# EAGLE design main (EAGLE 9.0.1)
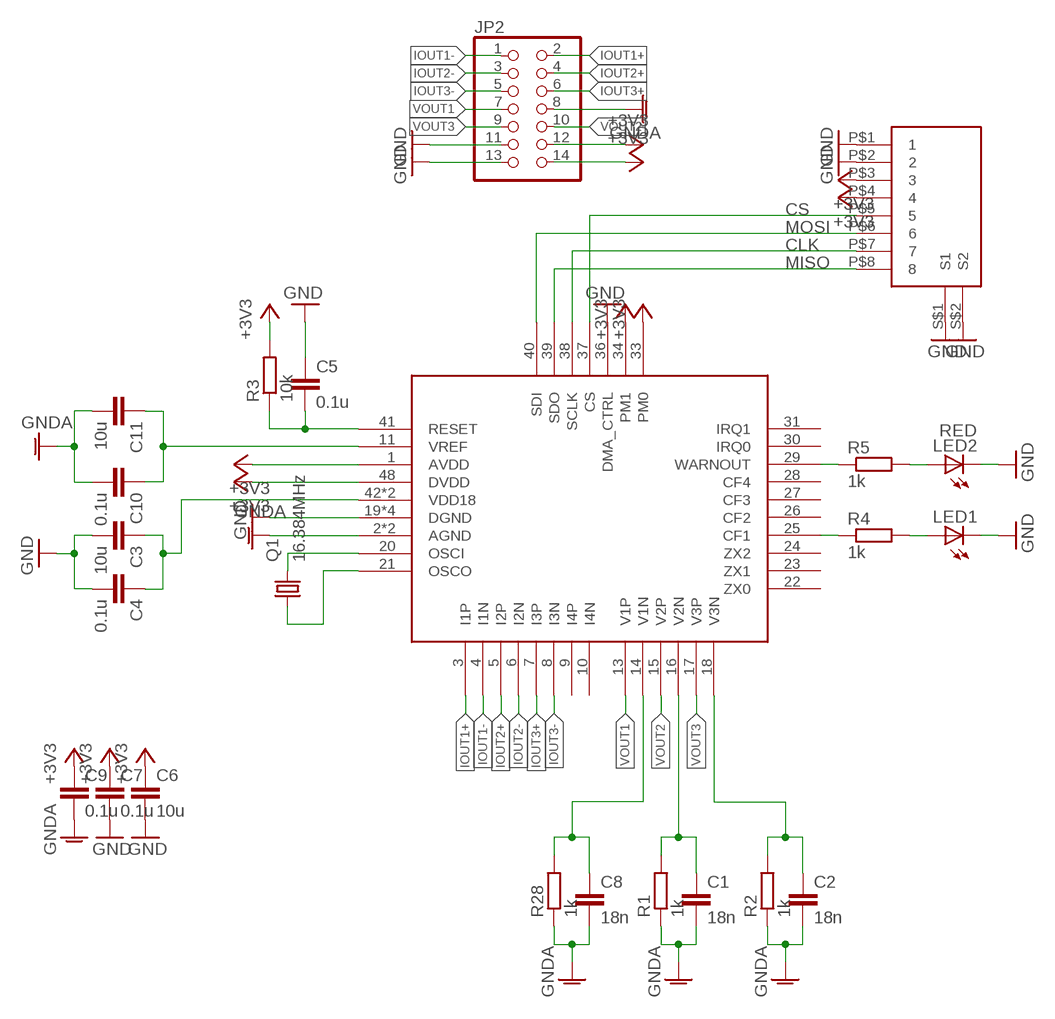
[diagram p0: schematic, sheet 1]

## Parts
C1  18n  C-EUC0805  [C0805]
C2  18n  C-EUC0805  [C0805]
C3  10u  C-EUC1206  [C1206]
C4  0.1u  C-EUC0805  [C0805]
C5  0.1u  C-EUC0805  [C0805]
C6  10u  C-EUC1206  [C1206]
C7  0.1u  C-EUC0805  [C0805]
C8  18n  C-EUC0805  [C0805]
C9  0.1u  C-EUC0805  [C0805]
C10  0.1u  C-EUC0805  [C0805]
C11  10u  C-EUC0805  [C0805]
C12  RJ45-ASSMANN  [RJ45-ASSMANN]
JP2  PINHD-2X7  [2X07]
LED1  LEDCHIPLED_1206  [CHIPLED_1206]
LED2  RED  LEDCHIPLED_1206  [CHIPLED_1206]
Q1  16.384MHz  KX-9A  [5.0X3.2_KX-9A]
R1  1k  R-EU_M0805  [M0805]
R2  1k  R-EU_M0805  [M0805]
R3  10k  R-EU_M0805  [M0805]
R4  1k  R-EU_R0805  [R0805]
R5  1k  R-EU_R0805  [R0805]
R28  1k  R-EU_M0805  [M0805]
U$1  ATM90E36A  [QFP50P900X900X120-48]

## Nets
+3V3: C6.1 C7.1 C9.1 C12.P$3 C12.P$4 JP2.12 JP2.14 R3.2 U$1.1(AVDD) U$1.33(PM0) U$1.34(PM1) U$1.48(DVDD)
CLK: C12.P$7 U$1.38(SCLK)
CS: C12.P$5 U$1.37(CS)
GND: C3.2 C4.2 C5.1 C6.2 C7.2 C12.P$1 C12.P$2 C12.S$1(S1) C12.S$2(S2) JP2.11 JP2.13 LED1.C LED2.C U$1.19(DGND) U$1.32(DGND) U$1.36(DMA_CTRL) U$1.44(DGND) U$1.47(DGND)
GNDA: C1.2 C2.2 C8.2 C9.2 C10.2 C11.2 JP2.8 R1.1 R2.1 R28.1 U$1.2(AGND) U$1.12(AGND)
IOUT1+: JP2.2 U$1.3(I1P)
IOUT1-: JP2.1 U$1.4(I1N)
IOUT2+: JP2.4 U$1.5(I2P)
IOUT2-: JP2.3 U$1.6(I2N)
IOUT3+: JP2.6 U$1.7(I3P)
IOUT3-: JP2.5 U$1.8(I3N)
MISO: C12.P$8 U$1.39(SDO)
MOSI: C12.P$6 U$1.40(SDI)
N$1: Q1.3 U$1.20(OSCI)
N$2: Q1.1 U$1.21(OSCO)
N$3: C5.2 R3.1 U$1.41(RESET)
N$4: C3.1 C4.1 U$1.42(VDD18) U$1.43(VDD18)
N$6: R4.1 U$1.25(CF1)
N$7: LED1.A R4.2
N$8: R5.1 U$1.29(WARNOUT)
N$9: LED2.A R5.2
VOUT1: JP2.7 U$1.13(V1P)
VOUT2: JP2.10 U$1.15(V2P)
VOUT3: JP2.9 U$1.17(V3P)
VOUT4: C8.1 R28.2 U$1.14(V1N)
VOUT5: C1.1 R1.2 U$1.16(V2N)
VOUT6: C2.1 R2.2 U$1.18(V3N)
VREF: C10.1 C11.1 U$1.11(VREF)
Unconnected: U$1.9(I4P) U$1.10(I4N) U$1.22(ZX0) U$1.23(ZX1) U$1.24(ZX2) U$1.26(CF2) U$1.27(CF3) U$1.28(CF4) U$1.30(IRQ0) U$1.31(IRQ1)

## Library data of the parts
C1-C11 = rcl:C-EU: CAPACITOR, European symbol; SPICEPREFIX: C
C12 = rj45:RJ45-ASSMANN
JP2 = pinhead:PINHD-2X7: PIN HEADER
LED1 LED2 = led:LED: LED OSRAM: - CHIPLED LG R971, LG N971, LY N971, LG Q971, LY Q971, LO R971, LY R971 LH N974, LH R974 LS Q976, LO Q976, LY Q976 LO Q996 - Hyper CHIPLED LW Q18S LB Q993, LB Q99A, LB R99A - SideLED LS A670, LO A670, LY A670, LG A670, LP A670 LB A673, LV A673, LT A673, LW A673 LH A674 LY A675 LS A676, LA A676, LO A676, LY A676, LW A676 LS A679, LY A679, LG A679 - Hyper Micro SIDELED® LS Y876, LA Y876, LO Y876, LY Y876 LT Y87S - SmartLED LW L88C, LW L88S LB L89C, LB L89S, LG L890 LS L89K, LO L89K, LY L89K LS L896, LA L896, LO L896, LY L896 - TOPLED LS T670, LO T670, LY T670, LG T670, LP T670 LSG T670, LSP T670, LSY T670, LOP T670, LYG T670 LG T671, LOG T671, LSG T671 LB T673, LV T673, LT T673, LW T673 LH T674 LS T676, LA T676, LO T676, LY T676, LB T676, LH T676, LSB T676, LW T676 LB T67C, LV T67C, LT T67C, LS T67K, LO T67K, LY T67K, LW E67C LS E67B, LA E67B, LO E67B, LY E67B, LB E67C, LV E67C, LT E67C LW T67C LS T679, LY T679, LG T679 LS T770, LO T770, LY T770, LG T770, LP T770 LB T773, LV T773, LT T773, LW T773 LH T774 LS E675, LA E675, LY E675, LS T675 LS T776, LA T776, LO T776, LY T776, LB T776 LHGB T686 LT T68C, LB T68C - Hyper Mini TOPLED® LB M676 - Mini TOPLED Santana® LG M470 LS M47K, LO M47K, LY M47K Source: http://www.osram.convergy.de LUXEON: - LUMILED® LXK2-PW12-R00, LXK2-PW12-S00, LXK2-PW14-U00, LXK2-PW14-V00 LXK2-PM12-R00, LXK2-PM12-S00, LXK2-PM14-U00 LXK2-PE12-Q00, LXK2-PE12-R00, LXK2-PE12-S00, LXK2-PE14-T00, LXK2-PE14-U00 LXK2-PB12-K00, LXK2-PB12-L00, LXK2-PB12-M00, LXK2-PB14-N00, LXK2-PB14-P00, LXK2-PB14-Q00 LXK2-PR12-L00, LXK2-PR12-M00, LXK2-PR14-Q00, LXK2-PR14-R00 LXK2-PD12-Q00, LXK2-PD12-R00, LXK2-PD12-S00 LXK2-PH12-R00, LXK2-PH12-S00 LXK2-PL12-P00, LXK2-PL12-Q00, LXK2-PL12-R00 Source: www.luxeon.com KINGBRIGHT: KA-3528ASYC Source: www.kingbright.com
Q1 = crystal-geyer_V1_0:KX: Quartz Crystals (MHz) SMD: KX - Serie Model Size l/w/h [mm] Frequency Range Frequency Stability Temp. Range [°C] Load Capacitance AECQ 200 availabel Datasheet KX-4 KX-5 KX-6 KX-7 KX-9A KX-9B KX-12A KX-12B KX-13 KX-20 KX-K KX-KS 1.6/1.2/0.3 2.0/1.6/0.45 2.5/2.0/0.55 3.2/2.5/0.8 5.0/3.2/1.0 5.0/3.2/1.1 6.0/3.5/1.1 6.0/3.5/1.0 7.0/5.0 /1.3 11.6/5.5/1.6 12.3/4.5/4.2 12.3/4.5/3.2 24.0 ~ 80.0 MHz 16.0 ~ 80.0 MHz 12.0 ~ 80.0 MHz 8.0 ~ 60.0 MHz 7,68 ~ 300,0 MHz 8,0 ~ 50,0 MHz 8,0 ~ 150,0 MHz 8,0 ~ 50,0 MHz 6,0 ~ 160,0 MHz 3,579 ~ 25,0 MHz 3,579 ~ 70,0 MHz 3,579 ~ 70,0 MHz ±10 … ±50ppm ±10 … ±50ppm ±10 … ±50ppm ±10 … ±50ppm ±10 … ±50ppm ±10 … ±50ppm ±10 … ±50ppm ±10 … ±50ppm ±10 … ±50ppm ±50ppm ±10 … ±50ppm ±10 … ±50ppm (*) -40°C …+85°C (*) -40°C …+125°C (*) -40°C …+125°C (*) -40°C …+125°C (*) -40°C …+105°C (*) -40°C …+105°C (*) -40°C …+125°C (*) -40°C …+105°C (*) -40°C …+105°C (*) -40°C …+105°C (*) -40°C …+85°C (*) -40°C …+85°C 8, 8…16 8, 8…16 10, 8…16 12, 7…20 16, 10…20 16, 10…20 16, 10…20 16, 12…20 16, 12…20 16, 12…20 16, 12…30 16, 12…30 - yes yes yes - - - - - - - - KX-4.pdf <http://www.geyer-electronic.de/uploads/tx_userartikelfrequenz/GEYER-KX-4.pdf> KX-5.pdf <http://www.geyer-electronic.de/uploads/tx_userartikelfrequenz/GEYER-KX-5.pdf> KX-6.pdf <http://www.geyer-electronic.de/uploads/tx_userartikelfrequenz/GEYER-KX-6.pdf> KX-7.pdf <http://www.geyer-electronic.de/uploads/tx_userartikelfrequenz/GEYER-KX-7.pdf> KX-9A.pdf <http://www.geyer-electronic.de/uploads/tx_userartikelfrequenz/GEYER-KX-9A.pdf> KX-9B.pdf <http://www.geyer-electronic.de/uploads/tx_userartikelfrequenz/GEYER-KX-9B.pdf> KX-12A.pdf <http://www.geyer-electronic.de/uploads/tx_userartikelfrequenz/GEYER-KX-12A.pdf> KX-12B.pdf <http://www.geyer-electronic.de/uploads/tx_userartikelfrequenz/GEYER-KX-12B.pdf> KX-13.pdf <http://www.geyer-electronic.de/uploads/tx_userartikelfrequenz/GEYER-KX-13.pdf> KX-20.pdf <http://www.geyer-electronic.de/uploads/tx_userartikelfrequenz/GEYER-KX-20.pdf> KX-K.pdf <http://www.geyer-electronic.de/uploads/tx_userartikelfrequenz/GEYER-KX-K.pdf> KX-KS.pdf <http://www.geyer-electronic.de/uploads/tx_userartikelfrequenz/GEYER-KX-KS.pdf> <http://www.geyer-electronic.de/fileadmin/template/img/logo-geyer-electronic.png> Details see: http://www.geyer-electronic.de/Frequenz-Produkte.9.0.html Created 2016-06-07, Hans Locher 2016 (C) Geyer Quartz Technology KX4,KX5,KX6,KX7,KX9A,KX9B,KX12A,KX12B,KX13,KX20,KXK,KXKS;1612;2016;2520;3225;5032;6035;7050;11655;12345;1,6x1,2;2,0x1,6;2,5x2,0;3,2x2,5;5,0x3,2;6,0x3,5;7,0x5,0;11,6x5,5;12,3x4,5;12,3x4,5;1.6x1.2;2.0x1.6;2.5x2.0;3.2x2.5;5.0x3.2;6.0x3.5;7.0x5.0;11.6x5.5;12.3x4.5;12.3x4.5;
R1-R5 R28 = rcl:R-EU_: RESISTOR, European symbol; SPICEPREFIX: R
U$1 = ATM90E36:ATM90E36A

## Board
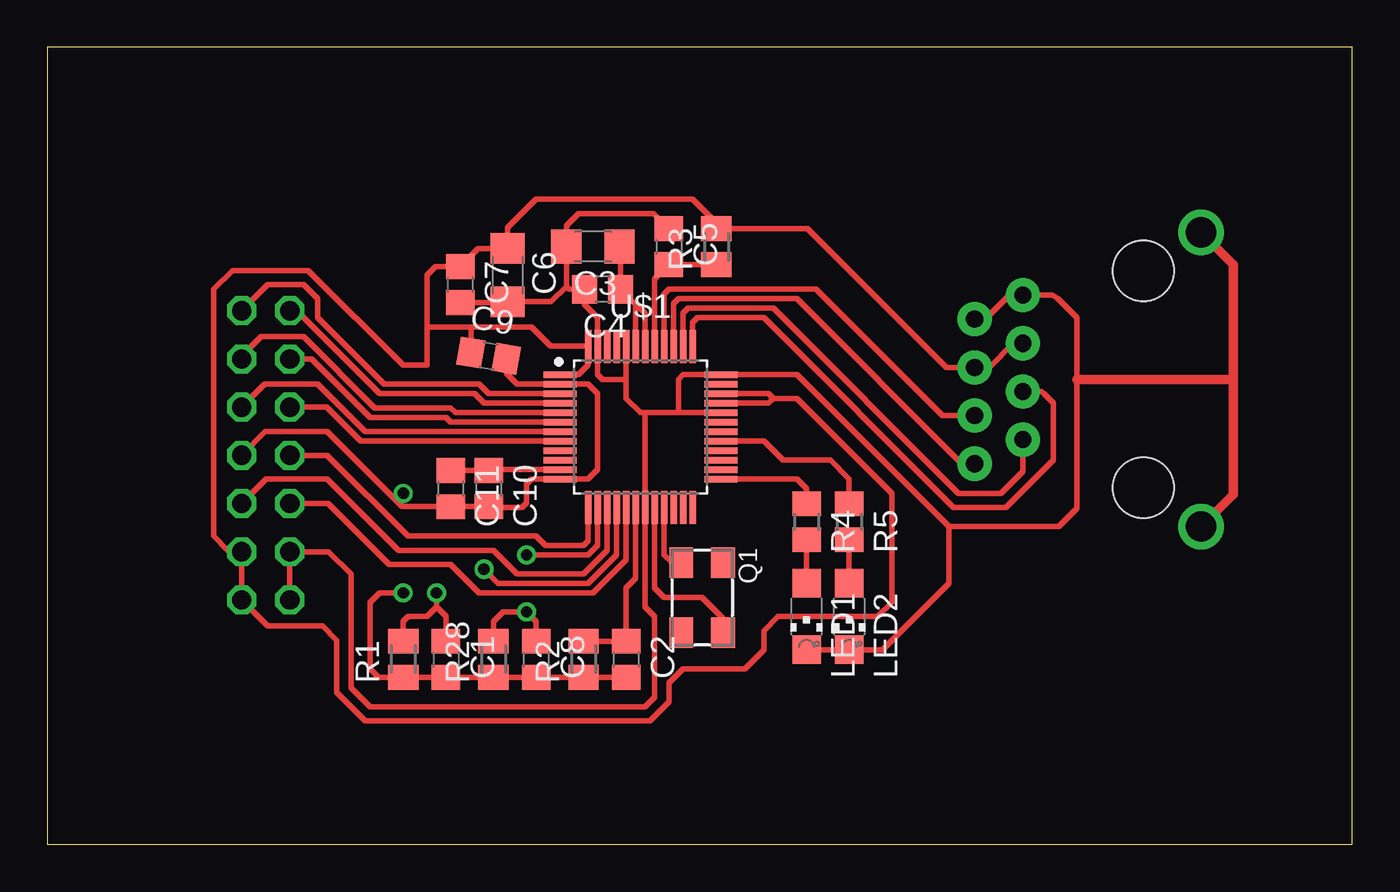
[diagram p1: board, top side]
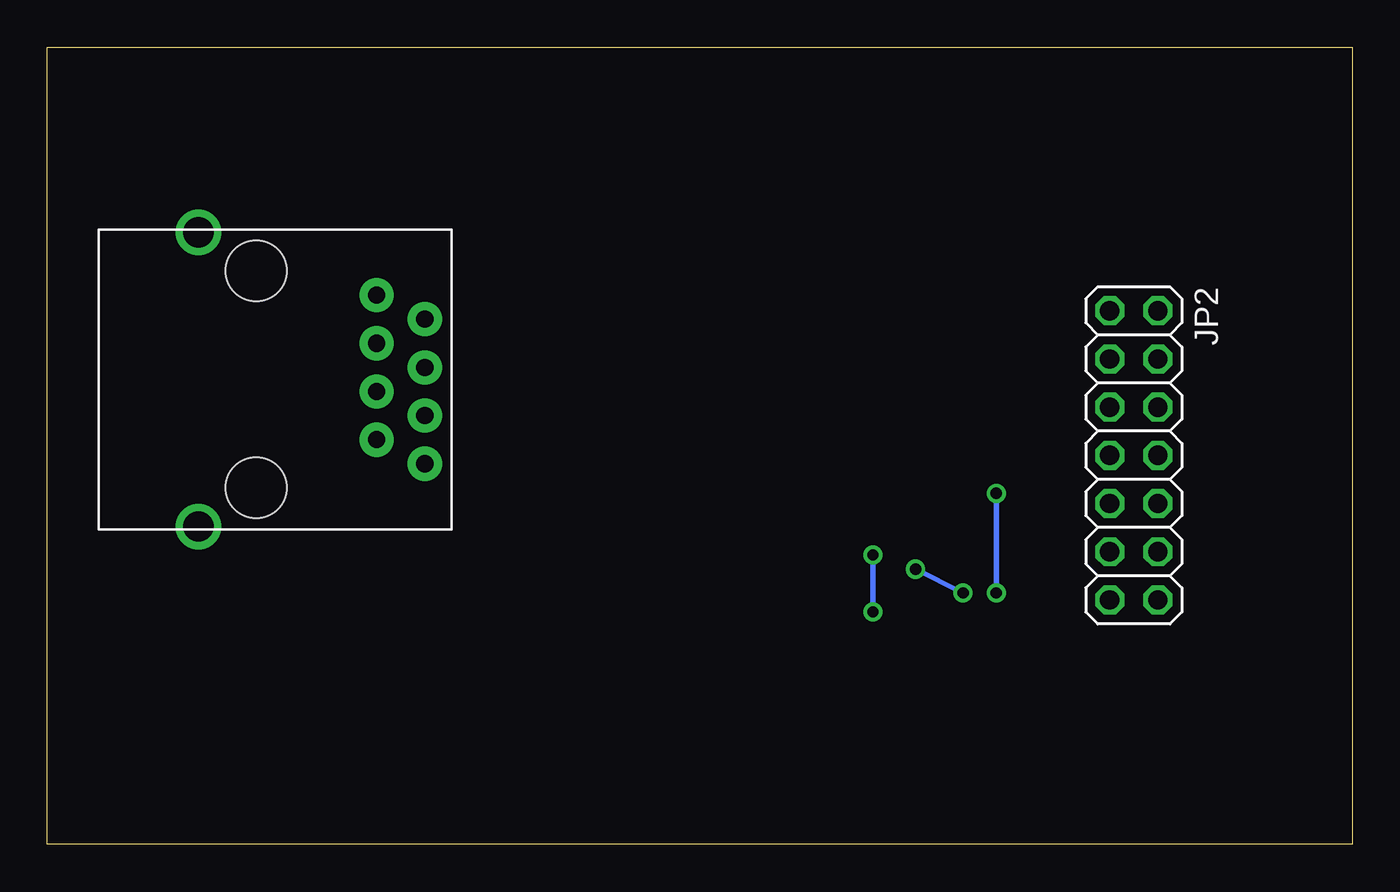
[diagram p2: board, bottom side, seen from below]

Size 68.75 x 42 mm. Coordinates in mm from the lower left corner, seen from the top.
Outline: 0,0 68.75,0 68.75,42 0,42 0,0
Copper layers (1*16): Top 0.035mm / dielectric 1.5mm / Bottom 0.035mm
Design rules "default": minimum track width 6mil, minimum drill 0.35mm, track to track 6mil, track to pad 6mil, pad to pad 6mil, via to via 6mil, smd to smd 6mil, copper to edge 40mil, drill to drill 6mil, minimum pad ring 10mil, minimum via ring 8mil, stop-mask expansion 4mil, vias tented up to drill 0mil, thermal gap 10mil

### Footprints (pad centres in the part's own frame; a part is rotated, then mirrored left to right if it is on the bottom)
C0805 = smd 1.3 x 1.5: 1 -0.95,0; 2 0.95,0
C1206 = smd 1.6 x 1.8: 1 -1.4,0; 2 1.4,0
RJ45-ASSMANN = drill 0.9 pad 1.8: P$1 -4.445,6.35; P$2 -3.175,8.89; P$3 -1.905,6.35; P$4 -0.635,8.89; P$5 0.635,6.35; P$6 1.905,8.89; P$7 3.175,6.35; P$8 4.445,8.89 | drill 1.6: S$1 -7.75,-3.05; S$2 7.75,-3.05 | hole 3.2: -5.715,0; 5.715,0
2X07 = drill 1.016 octagon: 1 -7.62,-1.27; 2 -7.62,1.27; 3 -5.08,-1.27; 4 -5.08,1.27; 5 -2.54,-1.27; 6 -2.54,1.27; 7 0,-1.27; 8 0,1.27; 9 2.54,-1.27; 10 2.54,1.27; 11 5.08,-1.27; 12 5.08,1.27; 13 7.62,-1.27; 14 7.62,1.27
CHIPLED_1206 = smd 1.5 x 1.5: A 0,-1.75; C 0,1.75
5.0X3.2_KX-9A = smd 1.6 x 1.25: 1 -1.85,-1.1; 2 1.85,-1.1; 3 1.85,1.1; 4 -1.85,1.1
M0805 = smd 1.3 x 1.6: 1 -0.95,0; 2 0.95,0
R0805 = smd 1.3 x 1.5: 1 -0.95,0; 2 0.95,0
QFP50P900X900X120-48 = smd 1.737 x 0.34: 1 -4.237,2.75; 2 -4.237,2.25; 3 -4.237,1.75; 4 -4.237,1.25; 5 -4.237,0.75; 6 -4.237,0.25; 7 -4.237,-0.25; 8 -4.237,-0.75; 9 -4.237,-1.25; 10 -4.237,-1.75; 11 -4.237,-2.25; 12 -4.237,-2.75; 25 4.237,-2.75; 26 4.237,-2.25; 27 4.237,-1.75; 28 4.237,-1.25; 29 4.237,-0.75; 30 4.237,-0.25; 31 4.237,0.25; 32 4.237,0.75; 33 4.237,1.25; 34 4.237,1.75; 35 4.237,2.25; 36 4.237,2.75 | smd 0.34 x 1.737: 13 -2.75,-4.237; 14 -2.25,-4.237; 15 -1.75,-4.237; 16 -1.25,-4.237; 17 -0.75,-4.237; 18 -0.25,-4.237; 19 0.25,-4.237; 20 0.75,-4.237; 21 1.25,-4.237; 22 1.75,-4.237; 23 2.25,-4.237; 24 2.75,-4.237; 37 2.75,4.237; 38 2.25,4.237; 39 1.75,4.237; 40 1.25,4.237; 41 0.75,4.237; 42 0.25,4.237; 43 -0.25,4.237; 44 -0.75,4.237; 45 -1.25,4.237; 46 -1.75,4.237; 47 -2.25,4.237; 48 -2.75,4.237

### Placement (x,y rotation side)
C1  21,9.75 270 top
C2  30.5,9.75 270 top
C3  28.75,31.5 180 top
C4  29.25,29.25 180 top
C5  32.75,31.5 270 top
C6  24.25,30 270 top
C7  21.75,29.5 270 top
C8  25.75,9.75 270 top
C9  23.25,25.75 350 top
C10  23.25,18.75 270 top
C11  21.25,18.75 270 top
C12  57.75,24.5 270 bottom
JP2  11.5,20.5 270 bottom
LED1  40,12 180 top
LED2  42.25,12 180 top
Q1  34.5,13 270 top
R1  18.75,9.75 90 top
R2  28.25,9.75 90 top
R3  35.25,31.5 90 top
R4  40,17 270 top
R5  42.25,17 270 top
R28  23.5,9.75 90 top
U$1  31.25,22 0 top

### Tracks (layer width: path | path; a pad name or v marks a point on that pad's centre or on a via)
+3V3
  Top 0.3: U$1.1 28,24.75 28.5,25.25 U$1.48 28.49,26.25 26.5,26.25 25.5,27.25 22.25,27.25 | 20,27.25 20,30 20.45,30.45 C7.1 22.7,31.4 C6.1 24.25,32.5 25.75,34 34,34 35.25,32.75 R3.2 40.05,32.45 47.37,25.14 C12.P$4 49.63,25.14 50.91,26.41 C12.P$3 | 20,27.25 20,25.25 18.75,25.25 13.75,30.25 9.75,30.25 8.75,29.25 8.75,16.25 9.5,15.5 10.15,15.5 JP2.12 JP2.14 11.61,11.5 14.5,11.5 15.25,10.75 15.25,8 16.75,6.5 31.75,6.5 32.75,7.5 32.75,8.5 33.5,9.25 36.75,9.25 37.75,10.25 37.75,11.25 38.5,12 43.75,12 44.5,12.75 44.5,18.5 39.5,23.5 38.25,23.5 | 22.25,27.25 20,27.25 | C9.1 22.31,27.19 22.25,27.25 | U$1.34 38,23.75 38.25,23.5 | 38.25,23.5 38,23.25 U$1.33
CLK
  Top 0.3: U$1.38 33.5,28 33.75,28.25 38.25,28.25 48,18.5 50.25,18.5 51.4,19.65 C12.P$7
CS
  Top 0.3: U$1.37 34,27.5 34.25,27.75 37.75,27.75 47.75,17.75 50.5,17.75 53,20.25 53,23.25 52.5,23.75 52.37,23.86 C12.P$5
GND
  Top 0.3: 27.35,29.4 C3.2 27.35,32.6 28,33.25 31.95,33.25 C5.1 | 27.35,29.4 27.5,29.25 C4.2 28.3,28.45 29,27.75 U$1.47 29,24.75 29.25,24.5 30.5,24.5 | U$1.44 30.5,24.5 | 30.5,24.5 30.5,23.5 31.25,22.75 31.5,22.75 | 31.5,22.75 33.25,22.75 | 33.25,22.75 U$1.32 | 31.5,22.75 U$1.19 31.5,12.5 32,12 32,7.75 31.5,7.25 17,7.25 16,8.25 16,14.25 14.83,15.42 JP2.11 JP2.13 | C7.2 24.2,28.55 C6.2 26.55,28.6 27.35,29.4 | 33.25,22.75 33.25,24.5 33.5,24.75 U$1.36 39.5,24.75 47.5,16.75 | C12.P$2 49.42,27.68 50.75,29 50.8,28.95 C12.P$1 52.95,28.95 53.25,28.75 54.25,27.75 54.25,24.5 54.25,17.7 53.3,16.75 47.5,16.75 | LED1.C LED2.C 44,10.25 47.5,13.75 47.5,16.75
  Top 0.5: C12.S$1 62.5,30.55 62.5,24.5 | C12.S$2 62.5,18.45 62.5,24.5 | 62.5,24.5 54.25,24.5
GNDA  (via drill 0.6)
  Top 0.3: JP2.8 11.48,21.75 14.75,21.75 18.38,18.12 | 18.38,18.12 18.7,17.8 C11.2 C10.2 23.3,17.75 25,17.75 25.25,18 25.25,19 25.5,19.25 U$1.12 28.5,19.25 29,19.75 29,23.75 28.5,24.25 U$1.2 24.75,24.25 24.19,24.81 C9.2 | C2.2 R2.1 C8.2 R28.1 C1.2 R1.1 17.45,8.8 17,9.25 17,12.75 17.5,13.25 v18.75,13.25 | v18.75,18.5 18.38,18.12
  Bottom 0.3: v18.75,13.25 v18.75,18.5
IOUT1+
  Top 0.3: U$1.3 23.25,23.75 22.75,24.25 17.75,24.25 14.25,27.75 14.25,28.75 13.5,29.5 11.61,29.5 JP2.2
IOUT1-
  Top 0.3: U$1.4 23,23.25 22.5,23.75 17.5,23.75 13.13,28.12 JP2.1
IOUT2+
  Top 0.3: U$1.5 21.5,22.75 21.25,23 17.25,23 13.5,26.75 11.25,26.75 10.23,25.73 JP2.4
IOUT2-
  Top 0.3: U$1.6 21.25,22.25 21,22.5 17,22.5 13.92,25.58 JP2.3
IOUT3+
  Top 0.3: U$1.7 16.75,21.75 14.25,24.25 11.44,24.25 JP2.6
IOUT3-
  Top 0.3: JP2.5 14.71,23.04 16.5,21.25 U$1.8
MISO
  Top 0.3: U$1.39 33,28.5 33.25,28.75 36.75,28.75 36.95,28.75 39.5,28.75 48.2,20.05 C12.P$8 48.8,20
MOSI
  Top 0.3: U$1.40 32.5,29 32.75,29.25 40.5,29.25 47.16,22.59 C12.P$6
N$1
  Top 0.3: U$1.20 32,13.5 32.5,13 34.5,13 35.6,11.9 Q1.3
N$2
  Top 0.3: U$1.21 32.5,15.25 32.9,14.85 Q1.1
N$3
  Top 0.3: U$1.41 32,29.8 C5.2 R3.1
N$4
  Top 0.3: U$1.43 31,28.5 | U$1.42 31.5,28 31,28.5 | C3.1 30.2,31.45 C4.1 30.95,28.5 31,28.5
N$6
  Top 0.3: U$1.25 39.5,19.25 40,18.75 R4.1
N$7
  Top 0.3: R4.2 LED1.A
N$8
  Top 0.3: U$1.29 37.75,21.25 38.75,20.25 41.25,20.25 42.25,19.25 R5.1
N$9
  Top 0.3: R5.2 LED2.A
VOUT1
  Top 0.3: U$1.13 28.5,16 28.25,15.75 26.25,15.75 25.75,16.25 19,16.25 14.75,20.5 JP2.7
VOUT2
  Top 0.3: JP2.10 11.52,19.25 14.75,19.25 18.5,15.5 23.5,15.5 24.75,14.25 28.25,14.25 29.5,15.5 U$1.15
VOUT3
  Top 0.3: U$1.17 30.5,15 28.75,13.25 22.75,13.25 21.25,14.75 18,14.75 14.79,17.96 JP2.9
VOUT4  (via drill 0.6)
  Top 0.3: U$1.14 29,15.75 28.5,15.25 v25.25,15.25 | R28.2 23.5,11.75 24,12.25 v25.25,12.25 25.75,11.75 C8.1
  Bottom 0.3: v25.25,15.25 v25.25,12.25
VOUT5  (via drill 0.6)
  Top 0.3: U$1.16 30,15.25 28.5,13.75 23.75,13.75 v23,14.5 | v20.5,13.25 20.5,12.5 | 20.5,12.5 21,12 C1.1 | 20.5,12.5 20,12 19,12 18.75,11.75 R1.2
  Bottom 0.3: v23,14.5 v20.5,13.25
VOUT6
  Top 0.3: U$1.18 31,14 30.5,13.5 C2.1 R2.2
VREF
  Top 0.3: U$1.11 23.3,19.75 C10.1 C11.1